# EAGLE design hbb-v0 (EAGLE 7.4.0)
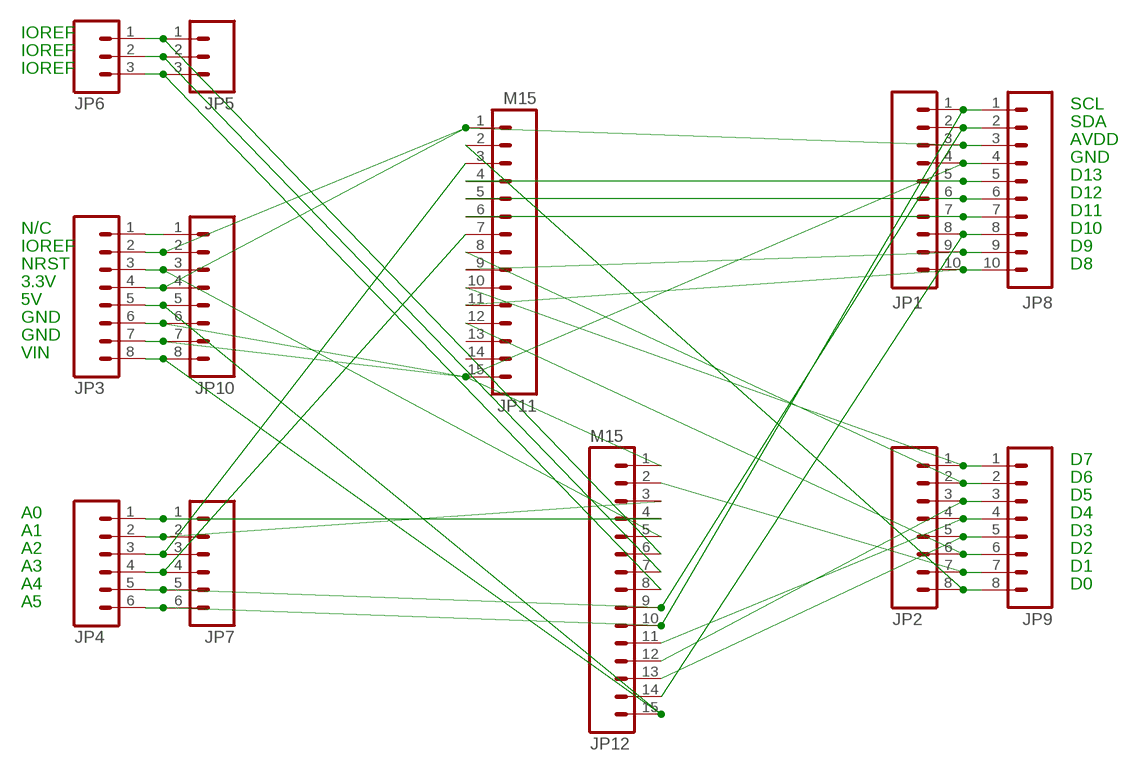
[diagram p0: schematic, sheet 1]

## Parts
JP1  M10NO_SILK_PTH_FEMALE  [1X10_NO_SILK]
JP2  M08NO_SILK_FEMALE_PTH  [1X08_NO_SILK]
JP3  M08NO_SILK_FEMALE_PTH  [1X08_NO_SILK]
JP4  M06NO_SILK_FEMALE_PTH  [1X06_NO_SILK]
JP5  M03LOCK_NO_SILK  [1X03_LOCK_NO_SILK]
JP6  M03PTH  [1X03]
JP7  M06NO_SILK_FEMALE_PTH  [1X06_NO_SILK]
JP8  M10NO_SILK_PTH_FEMALE  [1X10_NO_SILK]
JP9  M08NO_SILK_FEMALE_PTH  [1X08_NO_SILK]
JP10  M08NO_SILK_FEMALE_PTH  [1X08_NO_SILK]
JP11  M15  [1X15]
JP12  M15  [1X15]

## Nets
GND: JP1.4 JP3.6 JP3.7 JP8.4 JP10.6 JP10.7 JP11.15 JP12.1
N$1: JP5.1 JP6.1 JP12.6
N$2: JP5.2 JP6.2 JP12.7
N$3: JP5.3 JP6.3 JP12.8
N$4: JP4.1 JP7.1 JP12.4
N$5: JP4.2 JP7.2 JP12.3
N$6: JP4.3 JP7.3 JP11.3
N$7: JP4.4 JP7.4 JP11.7
N$8: JP1.2 JP4.5 JP7.5 JP8.2 JP12.9
N$9: JP1.1 JP4.6 JP7.6 JP8.1 JP12.10
N$14: JP1.5 JP8.5 JP11.4
N$15: JP1.6 JP8.6 JP11.5
N$16: JP1.7 JP8.7 JP11.6
N$17: JP1.8 JP8.8 JP12.14
N$18: JP1.9 JP8.9 JP11.9
N$19: JP1.10 JP8.10 JP11.11
N$20: JP2.1 JP9.1 JP11.10
N$21: JP2.2 JP9.2 JP11.8
N$22: JP2.3 JP9.3 JP12.12
N$23: JP2.4 JP9.4 JP12.11
N$24: JP2.5 JP9.5 JP12.13
N$25: JP2.6 JP9.6 JP11.12
N$26: JP2.7 JP9.7 JP12.2
N$27: JP2.8 JP9.8 JP11.2
N$28 [fat]: JP3.1 JP10.1
N$29: JP1.3 JP3.2 JP3.4 JP8.3 JP10.2 JP10.4 JP11.1
N$30: JP3.3 JP10.3 JP12.5
N$35: JP3.5 JP3.8 JP10.5 JP10.8 JP12.15
Unconnected: JP11.13 JP11.14

## Notes on the sheet
- IOREF
- IOREF
- IOREF
- SCL
- SDA
- AVDD
- GND
- D13
- D12
- D11
- N/C | D10
- IOREF | D9
- NRST | D8
- 3.3V
- 5V
- GND
- GND
- VIN
- D7
- D6
- D5
- A0 | D4
- A1 | D3
- A2 | D2
- A3 | D1
- A4 | D0
- A5

## Library data of the parts
JP1 JP8 = SparkFun-Connectors:M10: Header 10 Standard 10-pin 0.1" header. Use with straight break away headers (SKU : PRT-00116), right angle break away headers (PRT-00553), swiss pins (PRT-00743), machine pins (PRT-00117), and female headers (PRT-00115).; PROD_ID: CONN-11563
JP2 JP3 JP9 JP10 = SparkFun-Connectors:M08: Header 8 Standard 8-pin 0.1" header. Use with straight break away headers (SKU : PRT-00116), right angle break away headers (PRT-00553), swiss pins (PRT-00743), machine pins (PRT-00117), and female headers (PRT-00115).; PROD_ID: CONN-08438
JP4 JP7 = SparkFun-Connectors:M06: Header 6 Standard 6-pin 0.1" header. Use with straight break away headers (SKU : PRT-00116), right angle break away headers (PRT-00553), swiss pins (PRT-00743), machine pins (PRT-00117), and female headers (PRT-00115). Molex polarized connector foot print use with SKU : PRT-08094 with associated crimp pins and housings. NOTES ON THE VARIANTS LOCK and LOCK_LONGPADS... This footprint was designed to help hold the alignment of a through-hole component (i.e. 6-pin header) while soldering it into place. You may notice that each hole has been shifted either up or down by 0.005 of an inch from it's more standard position (which is a perfectly straight line). This slight alteration caused the pins (the squares in the middle) to touch the edges of the holes. Because they are alternating, it causes a "brace" to hold the component in place. 0.005 has proven to be the perfect amount of "off-center" position when using our standard breakaway headers. Although looks a little odd when you look at the bare footprint, once you have a header in there, the alteration is very hard to notice. Also,if you push a header all the way into place, it is covered up entirely on the bottom side. This idea of altering the position of holes to aid alignment will be further integrated into the Sparkfun Library for other footprints. It can help hold any component with 3 or more connection pins.; PROD_ID: CONN-08437
JP5 JP6 = SparkFun-Connectors:M03: Header 3 Standard 3-pin 0.1" header. Use with straight break away headers (SKU : PRT-00116), right angle break away headers (PRT-00553), swiss pins (PRT-00743), machine pins (PRT-00117), and female headers (PRT-00115). Molex polarized connector foot print use with SKU : PRT-08232 with associated crimp pins and housings.
JP11 JP12 = SparkFun-Connectors:M15: Header 15 Standard 15-pin 0.1" header. Use with straight break away headers (SKU : PRT-00116), right angle break away headers (PRT-00553), swiss pins (PRT-00743), machine pins (PRT-00117), and female headers (PRT-00115).

## Net classes
0 default: width 0.254 mm
1 fat: width 0.406 mm

## Board
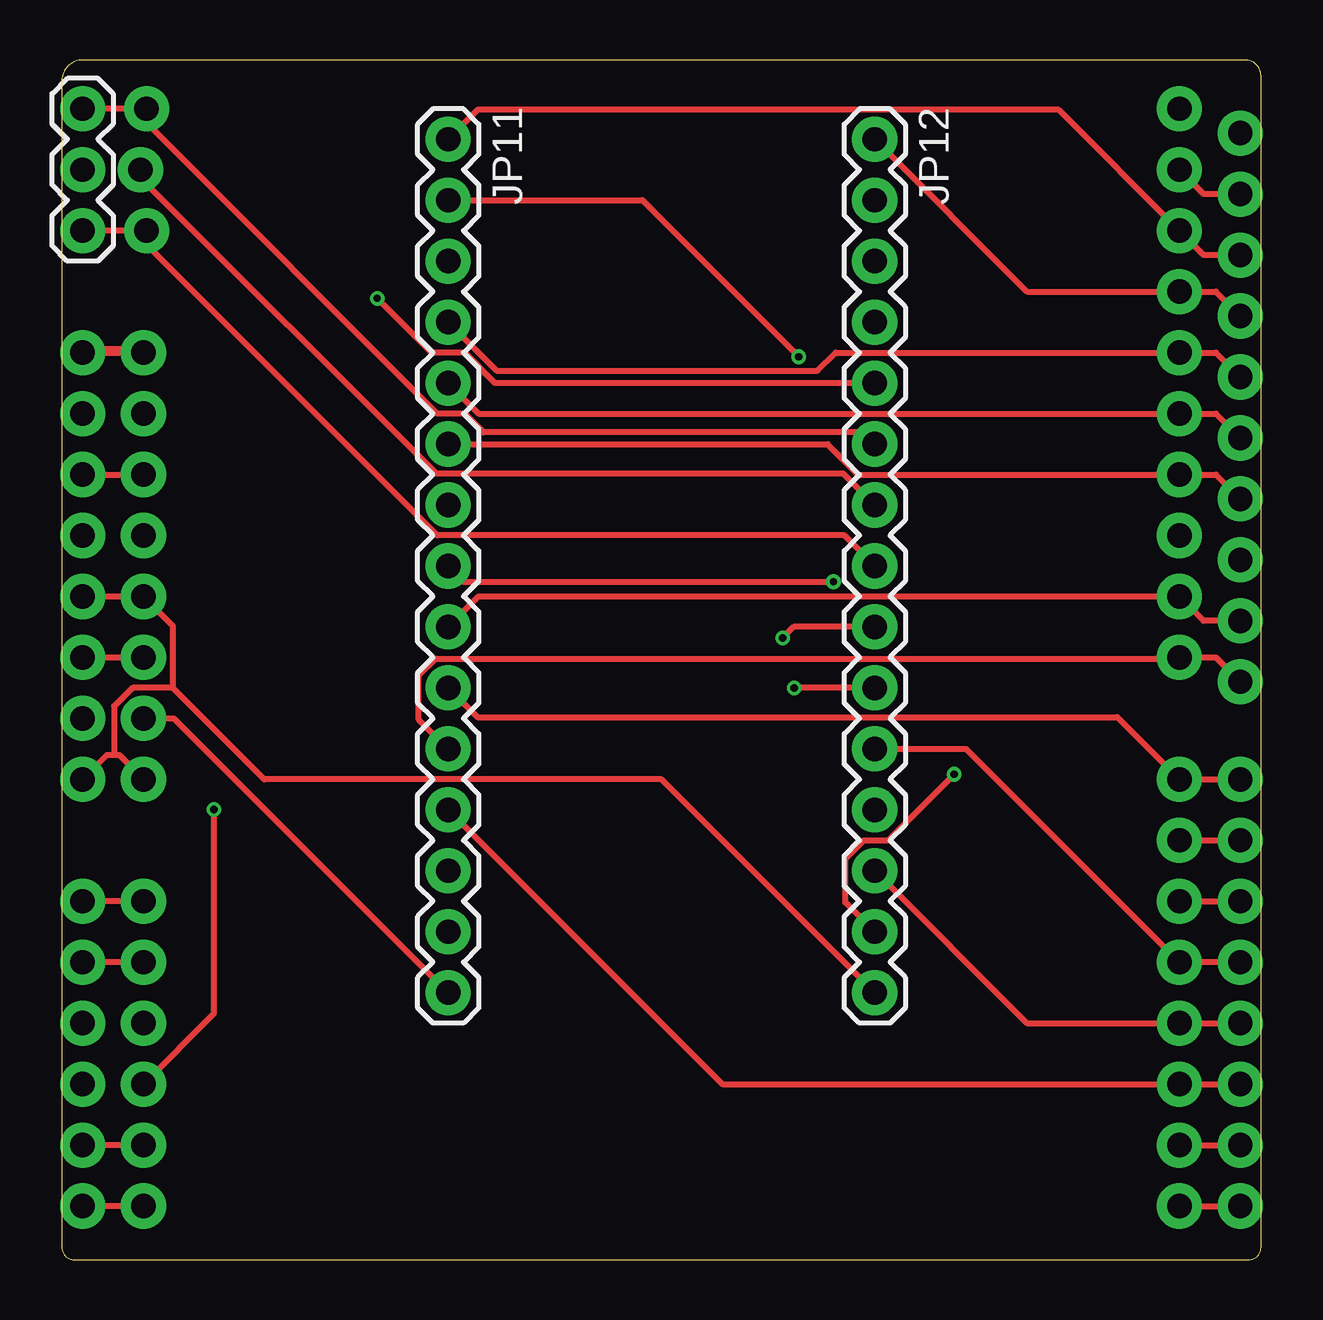
[diagram p1: board, top side]
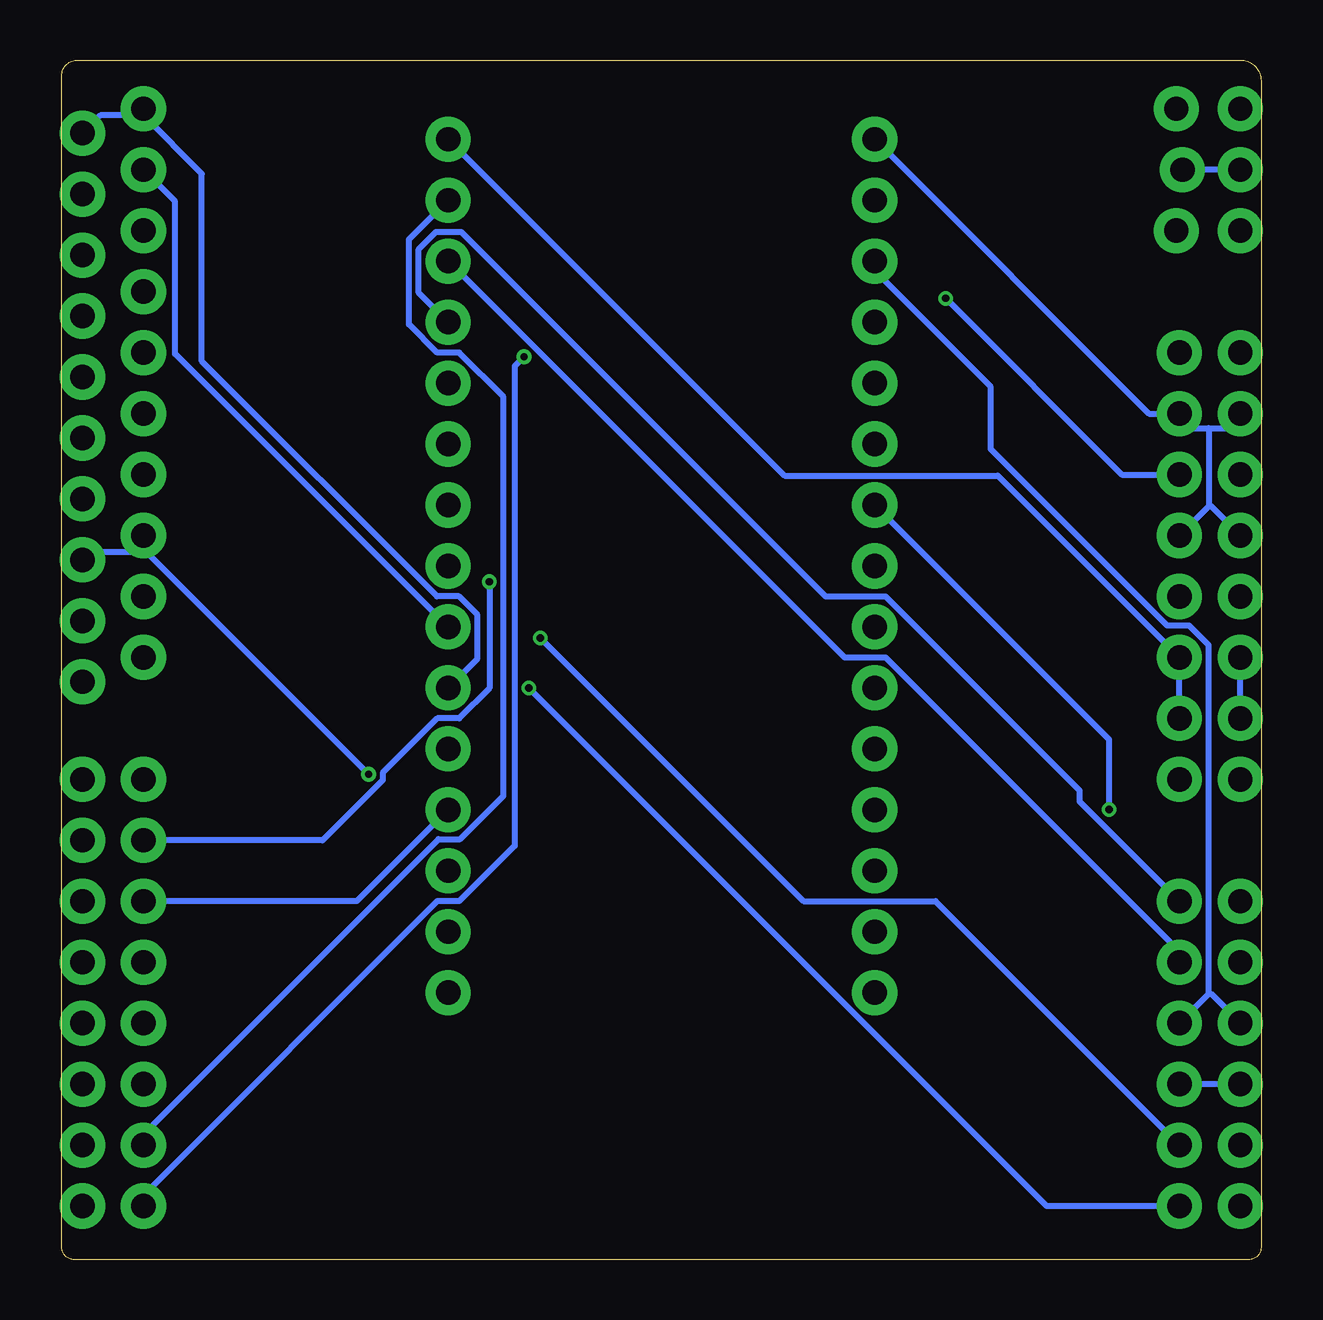
[diagram p2: board, bottom side, seen from below]

Size 49.99 x 49.99 mm. Coordinates in mm from the lower left corner, seen from the top.
Outline: 49.34,49.99 0.86,49.99 arc90 0,49.12 0,0.51 arc90 0.51,0 49.48,0 arc90 49.99,0.51 49.99,49.34 arc90 49.34,49.99
Copper layers (1*16): Top 0.035mm / dielectric 1.5mm / Bottom 0.035mm
Design rules "ITEADstudio_DRC": minimum track width 6mil, minimum drill 12mil, track to track 6mil, track to pad 6mil, pad to pad 6mil, via to via 6mil, smd to smd 0mil, copper to edge 10mil, drill to drill 10mil, minimum pad ring 10mil, minimum via ring 6mil, stop-mask expansion 2mil, vias tented up to drill 100mil, thermal gap 10mil

### Footprints (pad centres in the part's own frame; a part is rotated, then mirrored left to right if it is on the bottom)
1X10_NO_SILK = drill 1.016 pad 1.88: 1 0,0; 2 2.54,0; 3 5.08,0; 4 7.62,0; 5 10.16,0; 6 12.7,0; 7 15.24,0; 8 17.78,0; 9 20.32,0; 10 22.86,0
1X08_NO_SILK = drill 1.016 pad 1.88: 1 0,0; 2 2.54,0; 3 5.08,0; 4 7.62,0; 5 10.16,0; 6 12.7,0; 7 15.24,0; 8 17.78,0
1X06_NO_SILK = drill 1.016 pad 1.88: 1 0,0; 2 2.54,0; 3 5.08,0; 4 7.62,0; 5 10.16,0; 6 12.7,0
1X03_LOCK_NO_SILK = drill 1.016 pad 1.88: 1 0,0.127; 2 2.54,-0.127; 3 5.08,0.127
1X03 = drill 1.016 pad 1.88: 1 0,0; 2 2.54,0; 3 5.08,0
1X15 = drill 1.016 pad 1.88: 1 0,0; 2 2.54,0; 3 5.08,0; 4 7.62,0; 5 10.16,0; 6 12.7,0; 7 15.24,0; 8 17.78,0; 9 20.32,0; 10 22.86,0; 11 25.4,0; 12 27.94,0; 13 30.48,0; 14 33.02,0; 15 35.56,0

### Placement (x,y rotation side)
JP1  46.58,47.96 270 top
JP2  46.58,20.02 270 top
JP3  3.4,37.8 270 top
JP4  3.4,14.94 270 top
JP5  3.4,47.96 270 top
JP6  0.86,47.96 270 top
JP7  0.86,14.94 270 top
JP8  49.12,46.94 270 top
JP9  49.12,20.02 270 top
JP10  0.86,37.8 270 top
JP11  16.1,46.69 270 top
JP12  33.88,46.69 270 top

### Tracks (layer width: path | path; a pad name or v marks a point on that pad's centre or on a via)
GND
  Top 0.254: JP12.1 40.23,40.34 JP1.4 48.11,40.34 JP8.4 | JP3.7 4.67,22.56 JP11.15 | JP10.6 JP3.6
  Bottom 0.254: JP12.1 19.87,32.67 10.98,32.67 JP3.6 JP3.7 | JP10.7 JP10.6
N$1
  Top 0.254: JP12.6 33.39,34.48 17.58,34.48 16.8,35.26 15.65,35.26 3.53,47.37 JP5.1 JP6.1
N$2
  Top 0.254: JP5.2 3.28,45.08 15.6,32.76 32.57,32.76 JP12.7
  Bottom 0.254: JP6.2 JP5.2
N$3
  Top 0.254: JP12.8 32.61,30.18 15.65,30.18 3.53,42.29 JP5.3 JP6.3
N$4
  Top 0.254: JP4.1 JP7.1
  Bottom 0.254: JP12.4 35.11,40.29 35.11,42.11 34.39,42.83 33.34,42.83 18.15,27.64 15.65,27.64 7.57,19.56 7.57,19.1 JP4.1
N$5
  Top 0.254: JP4.2 JP7.2
  Bottom 0.254: JP12.3 33.87,41.61 17.36,25.1 15.65,25.1 3.4,12.85 JP4.2
N$6
  Bottom 0.254: 2.18,11.08 2.18,25.61 2.99,26.42 3.91,26.42 11.27,33.78 11.27,36.37 16.1,41.2 JP11.3 | 2.18,11.08 JP4.3 | 2.18,11.08 2.08,11.08 JP7.3
N$7  (via drill 0.3 pad 0.61)
  Top 0.254: v6.34,18.75 6.34,10.25 JP4.4
  Bottom 0.254: JP11.7 6.34,21.68 v6.34,18.75 | JP7.4 JP4.4
N$8  (via drill 0.3 pad 0.61)
  Top 0.254: JP12.9 30.5,26.37 v30.04,25.91 | JP4.5 JP7.5 | JP8.2 47.6,44.4 JP1.2
  Bottom 0.254: v30.04,25.91 19.07,14.94 13.56,14.94 JP4.5 | JP12.9 45.26,37.74 45.26,44.09 JP1.2
N$9  (via drill 0.3 pad 0.61)
  Top 0.254: JP12.10 v30.53,23.83 | JP4.6 JP7.6
  Bottom 0.254: JP4.6 8.94,2.24 v30.53,23.83 | 46.58,47.68 48.38,47.68 JP8.1 | JP12.10 32.66,25.04 32.66,26.87 33.43,27.64 34.34,27.64 44.15,37.44 44.15,45.25 46.58,47.68 | 46.58,47.68 JP1.1
N$14
  Top 0.254: JP11.4 18.13,37.04 31.51,37.04 32.26,37.8 JP1.5 48.11,37.8 JP8.5
N$15
  Top 0.254: JP8.6 48.11,35.26 JP1.6 17.37,35.26 JP11.5
N$16
  Top 0.254: JP11.6 31.92,33.99 33.19,32.72 JP1.7 48.11,32.72 JP8.7
N$17  (via drill 0.3 pad 0.61)
  Top 0.254: JP12.14 32.66,14.89 32.66,16.71 33.43,17.48 34.45,17.48 v37.2,20.23
  Bottom 0.254: 46.58,29.49 48.8,29.49 JP8.8 | v37.2,20.23 46.46,29.49 46.58,29.49 | 46.58,29.49 JP1.8
N$18
  Top 0.254: JP11.9 17.37,27.64 JP1.9 47.6,26.62 JP8.9
N$19
  Top 0.254: JP11.11 14.88,22.51 14.88,24.33 15.6,25.05 46.54,25.05 JP1.10 48.11,25.1 JP8.10
N$20
  Top 0.254: JP11.10 17.33,22.6 44,22.6 JP2.1 JP9.1
N$21  (via drill 0.3 pad 0.61)
  Top 0.254: JP11.8 16.76,28.25 v32.17,28.25 | JP2.2 JP9.2
  Bottom 0.254: v32.17,28.25 32.17,23.82 33.42,22.56 34.34,22.56 36.61,20.28 36.61,19.98 39.12,17.48 JP2.2
N$22
  Top 0.254: JP2.3 JP9.3
  Bottom 0.254: JP12.12 37.69,14.94 JP2.3
N$23
  Top 0.254: JP9.4 JP2.4 37.69,21.29 JP12.11
N$24
  Top 0.254: JP9.5 JP2.5 40.23,9.86 JP12.13
N$25
  Top 0.254: JP9.6 JP2.6 27.53,7.32 JP11.12
N$26
  Top 0.254: JP2.7 JP9.7
  Bottom 0.254: JP2.7 46.58,5.23 34.29,17.53 33.38,17.53 31.58,19.32 31.58,35.95 33.43,37.8 34.34,37.8 35.51,38.97 35.51,42.52 JP12.2
N$27  (via drill 0.3 pad 0.61)
  Top 0.254: JP11.2 24.2,44.15 v30.72,37.63 | JP2.8 JP9.8
  Bottom 0.254: v30.72,37.63 31.11,37.23 31.11,17.25 33.42,14.94 34.34,14.94 46.58,2.69 JP2.8
N$28
  Top 0.152: 3.35,37.85 JP3.1 | 0.91,37.85 JP10.1
  Top 0.406: 3.35,37.85 0.91,37.85
N$29
  Top 0.254: JP11.1 17.32,47.91 41.55,47.91 JP1.3 47.6,41.86 JP8.3
  Bottom 0.254: JP11.1 4.67,35.26 JP3.2 2.79,34.65 2.18,34.65 | 2.18,34.65 1.47,34.65 JP10.2 | 2.18,34.65 2.18,31.4 | 2.18,31.4 JP3.4 | 2.18,31.4 2.08,31.4 JP10.4
N$30  (via drill 0.3 pad 0.61)
  Top 0.254: JP12.5 18.07,36.53 16.8,37.8 15.41,37.8 v13.15,40.06 | JP10.3 JP3.3
  Bottom 0.254: v13.15,40.06 5.8,32.72 JP3.3
N$35
  Top 0.254: 2.18,21.03 2.39,21.03 JP3.8 | JP10.8 1.88,21.03 2.18,21.03 | 4.63,23.83 2.95,23.83 2.18,23.06 2.18,21.03 | JP12.15 24.99,20.02 8.44,20.02 4.63,23.83 | 4.63,23.83 4.63,26.41 JP3.5 JP10.5